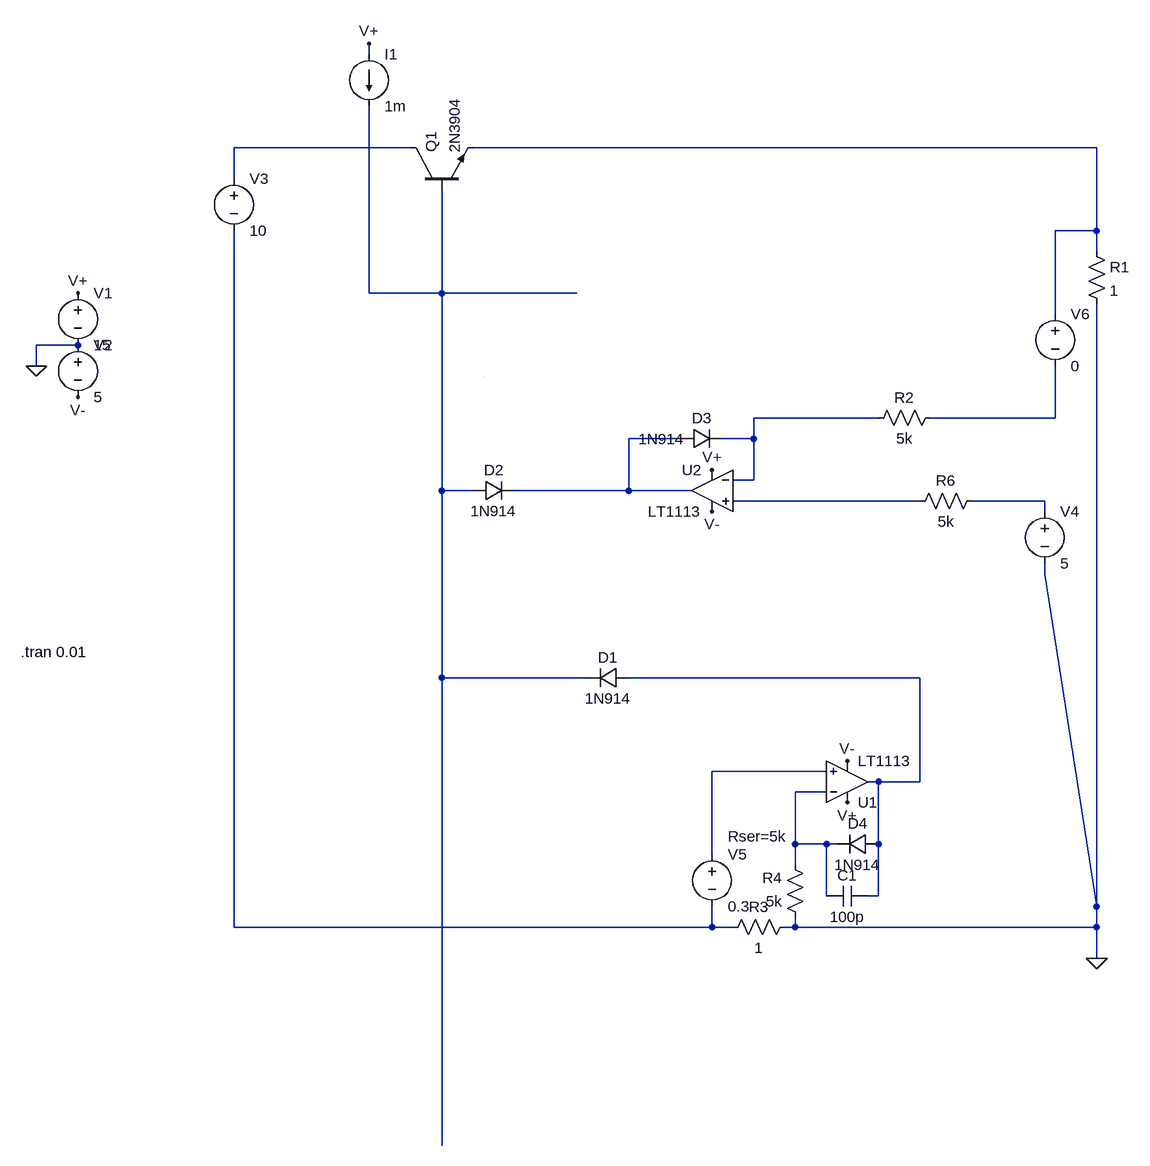
[diagram p0: schematic blackdog_experiment_bottom_reg.asc]
blackdog_experiment_bottom_reg.asc, the LTspice schematic file:
Version 4
SHEET 1 1012 1188
WIRE -176 -496 -176 -512
WIRE -112 -352 -384 -352
WIRE 944 -352 -16 -352
WIRE -384 -304 -384 -352
WIRE 944 -224 944 -352
WIRE 944 -224 880 -224
WIRE 944 -192 944 -224
WIRE -176 -128 -176 -416
WIRE -64 -128 -64 -288
WIRE -64 -128 -176 -128
WIRE 144 -128 -64 -128
WIRE 880 -96 880 -224
WIRE -624 -48 -688 -48
WIRE -688 -16 -688 -48
WIRE 608 64 416 64
WIRE 880 64 880 -16
WIRE 880 64 688 64
WIRE 304 96 224 96
WIRE 416 96 416 64
WIRE 416 96 368 96
WIRE 416 160 416 96
WIRE 416 160 384 160
WIRE -64 176 -64 -128
WIRE -16 176 -64 176
WIRE 224 176 224 96
WIRE 224 176 48 176
WIRE 320 176 224 176
WIRE 672 192 384 192
WIRE 864 192 752 192
WIRE 864 208 864 192
WIRE 864 304 864 288
WIRE -64 464 -64 176
WIRE 160 464 -64 464
WIRE 672 464 224 464
WIRE 528 608 352 608
WIRE 608 624 592 624
WIRE 672 624 672 464
WIRE 672 624 608 624
WIRE 528 640 480 640
WIRE 480 720 480 640
WIRE 528 720 480 720
WIRE 544 720 528 720
WIRE 608 720 608 624
WIRE 352 736 352 608
WIRE 480 752 480 720
WIRE 528 800 528 720
WIRE 608 800 608 720
WIRE 608 800 592 800
WIRE 944 816 944 -112
WIRE 944 816 864 304
WIRE -384 848 -384 -224
WIRE 352 848 352 816
WIRE 352 848 -384 848
WIRE 384 848 352 848
WIRE 480 848 480 832
WIRE 480 848 464 848
WIRE 944 848 944 816
WIRE 944 848 480 848
WIRE 944 896 944 848
WIRE -64 1184 -64 464
WIRE 0 0 0 0
FLAG -688 -16 0
FLAG -624 -128 V+
FLAG -624 32 V-
FLAG -176 -512 V+
FLAG 944 896 0
FLAG 560 656 V+
FLAG 352 208 V-
FLAG 560 592 V-
FLAG 352 144 V+
SYMBOL voltage -624 -144 R0
WINDOW 123 0 0 Left 0
WINDOW 39 0 0 Left 0
SYMATTR InstName V1
SYMATTR Value 15
SYMBOL voltage -624 -64 R0
WINDOW 123 0 0 Left 0
WINDOW 39 0 0 Left 0
SYMATTR InstName V2
SYMATTR Value 5
SYMBOL Opamps\\LT1113 560 688 M180
SYMATTR InstName U1
SYMBOL Opamps\\LT1113 352 112 M0
SYMATTR InstName U2
SYMBOL npn -112 -288 R270
SYMATTR InstName Q1
SYMATTR Value 2N3904
SYMBOL voltage -384 -320 R0
WINDOW 123 0 0 Left 0
WINDOW 39 0 0 Left 0
SYMATTR InstName V3
SYMATTR Value 10
SYMBOL current -176 -496 R0
WINDOW 123 0 0 Left 0
WINDOW 39 0 0 Left 0
SYMATTR InstName I1
SYMATTR Value 1m
SYMBOL diode 224 448 R90
WINDOW 0 0 32 VBottom 2
WINDOW 3 32 32 VTop 2
SYMATTR InstName D1
SYMATTR Value 1N914
SYMBOL diode -16 192 R270
WINDOW 0 32 32 VTop 2
WINDOW 3 0 32 VBottom 2
SYMATTR InstName D2
SYMATTR Value 1N914
SYMBOL res 928 -208 R0
SYMATTR InstName R1
SYMATTR Value 1
SYMBOL voltage 864 192 R0
WINDOW 123 0 0 Left 0
WINDOW 39 0 0 Left 0
SYMATTR InstName V4
SYMATTR Value 5
SYMBOL res 480 832 R90
WINDOW 0 0 56 VBottom 2
WINDOW 3 32 56 VTop 2
SYMATTR InstName R3
SYMATTR Value 1
SYMBOL res 496 848 R180
WINDOW 0 36 76 Left 2
WINDOW 3 36 40 Left 2
SYMATTR InstName R4
SYMATTR Value 5k
SYMBOL voltage 352 720 R0
WINDOW 123 0 0 Left 0
WINDOW 39 24 -12 Left 2
SYMATTR SpiceLine Rser=5k
SYMATTR InstName V5
SYMATTR Value 0.3
SYMBOL diode 608 704 R90
WINDOW 0 0 32 VBottom 2
WINDOW 3 32 32 VTop 2
SYMATTR InstName D4
SYMATTR Value 1N914
SYMBOL cap 528 816 R270
WINDOW 0 32 32 VTop 2
WINDOW 3 0 32 VBottom 2
SYMATTR InstName C1
SYMATTR Value 100p
SYMBOL res 704 48 R90
WINDOW 0 0 56 VBottom 2
WINDOW 3 32 56 VTop 2
SYMATTR InstName R2
SYMATTR Value 5k
SYMBOL res 768 176 R90
WINDOW 0 0 56 VBottom 2
WINDOW 3 32 56 VTop 2
SYMATTR InstName R6
SYMATTR Value 5k
SYMBOL diode 304 112 R270
WINDOW 0 32 32 VTop 2
WINDOW 3 31 -30 VBottom 2
SYMATTR InstName D3
SYMATTR Value 1N914
SYMBOL voltage 880 -112 R0
WINDOW 123 0 0 Left 0
WINDOW 39 0 0 Left 0
SYMATTR InstName V6
SYMATTR Value 0
TEXT -712 424 Left 2 !.tran 0.01

The netlist it stands for:
* blackdog_experiment_bottom_reg.asc
V1 V+ 0 15
V2 0 V- 5
XU1 N010 N011 V+ V- N009 LT1113  ; pins In+ In- V+ V- OUT
XU2 N007 N004 V+ V- N006 LT1113  ; pins In+ In- V+ V- OUT
Q1 N001 N003 N002 0 2N3904
V3 N001 N012 10
I1 V+ N003 1m
D1 N009 N003 1N914
D2 N003 N006 1N914
R1 N002 0 1
V4 N008 0 5
R3 0 N012 1
R4 0 N011 5k
V5 N010 N012 0.3 Rser=5k
D4 N009 N011 1N914
C1 N011 N009 100p
R2 N005 N004 5k
R6 N008 N007 5k
D3 N006 N004 1N914
V6 N002 N005 0
.model D D
.lib standard.dio
.model NPN NPN
.model PNP PNP
.lib standard.bjt
.tran 0.01
.backanno
.end